# Altium project BatteryBoard.PrjPcb
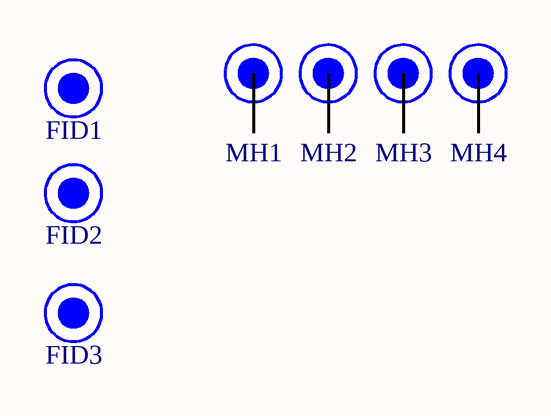
[diagram p0: Title.SchDoc]
Project_Date: 13/03/2019; Project_Designer1: Olivier Belval; Project_Designer2: Philippe Marcoux; Project_Global: SecurBot; Project_Group: SecurBot; Project_Name: BatteryBoard; Project_Revision: 1
6 sheets, 145 parts. Net scope: flat (ports and power ports of the same name join across sheets).
Board files: BatteryBoardTEST.PcbDoc, BatteryBoard.PcbDoc
Sheets:
  Title.SchDoc
  Battery Front End.SchDoc
  BatteryCharger.SchDoc
  MC.SchDoc
  ADC.SchDoc
  DC_DC_5V.SchDoc

## Sheet Title.SchDoc
size Tabloid; Date: Date; Author: Author 1; Revision: 1; Size: 11x17; Sheet_Name: Sheet Description

### Parts
FID1  Fiducial 1mm  [FID_1MM]  (value not drawn)
FID2  Fiducial 1mm  [FID_1MM]  (value not drawn)
FID3  Fiducial 1mm  [FID_1MM]  (value not drawn)
MH1  Mounting Hole 6/32  [MH_ENG_6-32]  (value not drawn)
MH2  Mounting Hole 6/32  [MH_ENG_6-32]  (value not drawn)
MH3  Mounting Hole 6/32  [MH_ENG_6-32]  (value not drawn)
MH4  Mounting Hole 6/32  [MH_ENG_6-32]  (value not drawn)

### Nets

Not connected (* = marked no-connect by the designer): MH1 1; MH2 1; MH3 1; MH4 1

### Notes on the sheet
- Revision history
- Package size conversion
- Metric
- 1005
- 1608
- Imperial
- 0402
- 0603
- Revision
- 2012
- 3216
- 0805
- 1206
- 3225
- 6432
- 1210
- 2512
- Date :
- Project Title
- Global Project
- Size
- Group
- Date
- Sheet
- of
- Filename
- Designers

### Library data of the parts
FID1-FID3 = FID - 1MM
MH1-MH4 = MH - 6-32

## Sheet Battery Front End.SchDoc
size Tabloid; Date: Date; Author: Author 1; Revision: 1; Size: 11x17; Sheet_Name: Battery front end
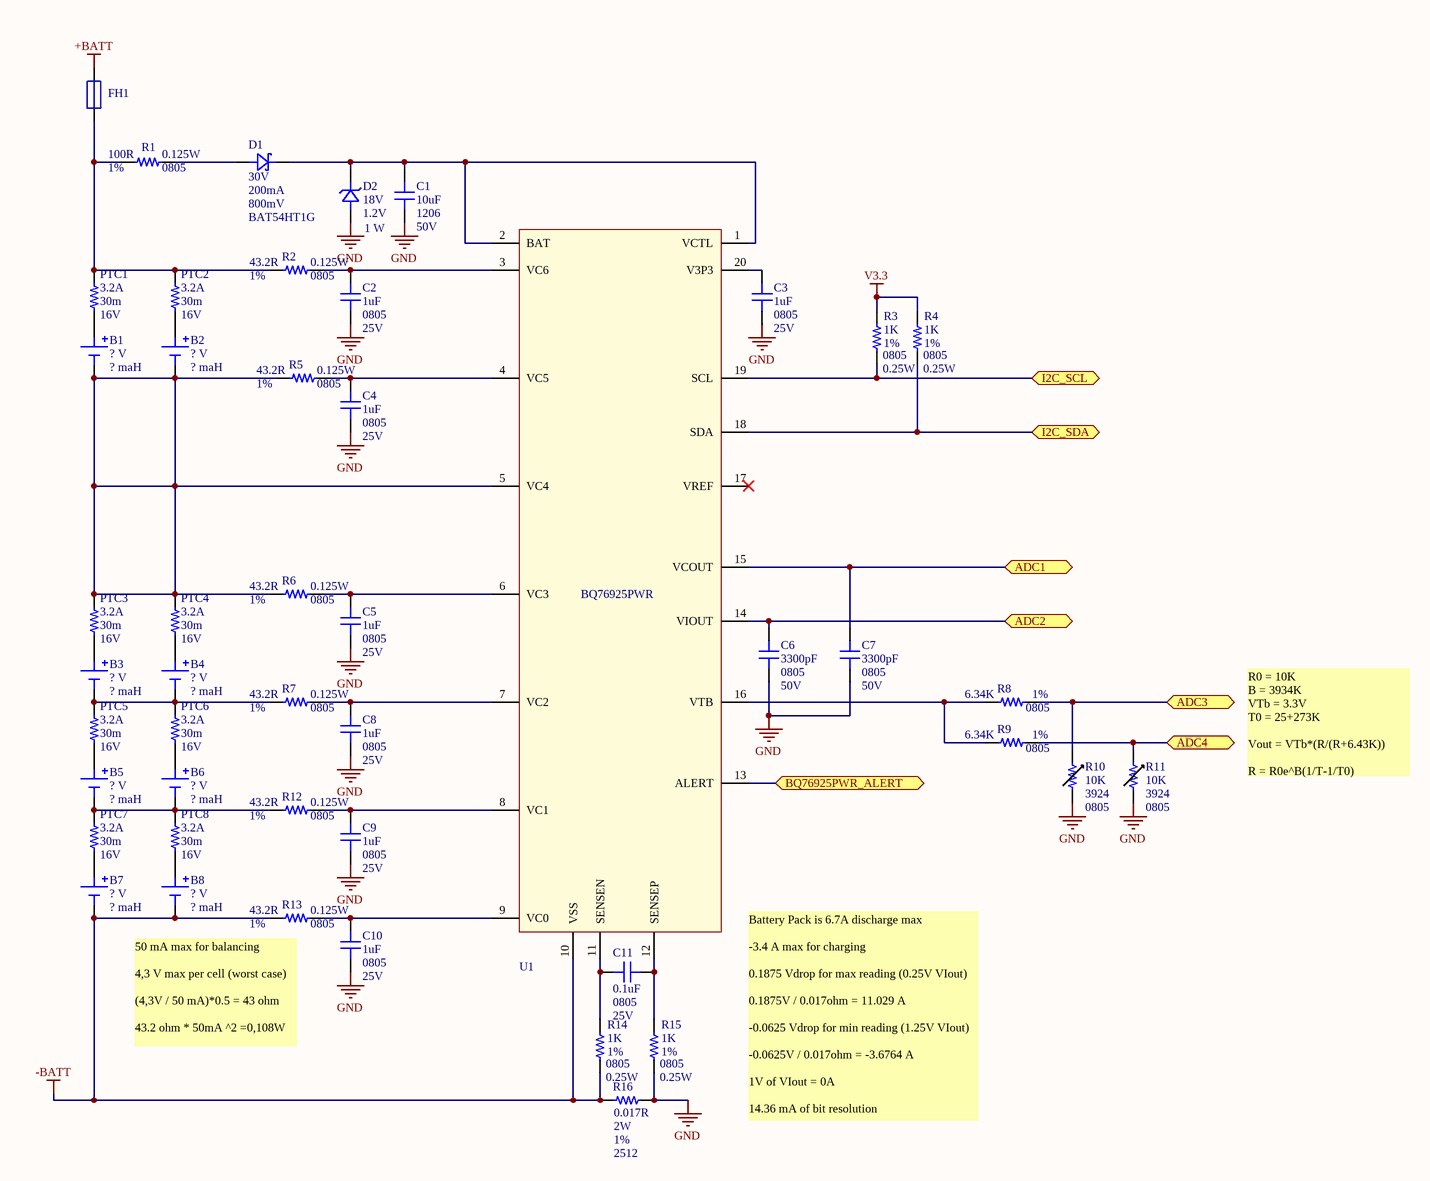
[diagram p1: Battery Front End.SchDoc]

### Parts
B1  Voltage: ? V  Charge: ? maH  [18650 PC PIN]  (hidden comment: Battery Cell 18650)
B2  Voltage: ? V  Charge: ? maH  [18650 PC PIN]  (hidden comment: Battery Cell 18650)
B3  Voltage: ? V  Charge: ? maH  [18650 PC PIN]  (hidden comment: Battery Cell 18650)
B4  Voltage: ? V  Charge: ? maH  [18650 PC PIN]  (hidden comment: Battery Cell 18650)
B5  Voltage: ? V  Charge: ? maH  [18650 PC PIN]  (hidden comment: Battery Cell 18650)
B6  Voltage: ? V  Charge: ? maH  [18650 PC PIN]  (hidden comment: Battery Cell 18650)
B7  Voltage: ? V  Charge: ? maH  [18650 PC PIN]  (hidden comment: Battery Cell 18650)
B8  Voltage: ? V  Charge: ? maH  [18650 PC PIN]  (hidden comment: Battery Cell 18650)
C1  value 10uF  Package: 1206  Voltage: 50V  [CAP_1206]  (hidden comment: CAP_GRT31CR61H106ME01L‎)
C2  value 1uF  Package: 0805  Voltage: 25V  [CAP_0805]  (hidden comment: CAP_‎‎‎‎CL21B105KAFNNNE‎)
C3  value 1uF  Package: 0805  Voltage: 25V  [CAP_0805]  (hidden comment: CAP_‎‎‎‎CL21B105KAFNNNE‎)
C4  value 1uF  Package: 0805  Voltage: 25V  [CAP_0805]  (hidden comment: CAP_‎‎‎‎CL21B105KAFNNNE‎)
C5  value 1uF  Package: 0805  Voltage: 25V  [CAP_0805]  (hidden comment: CAP_‎‎‎‎CL21B105KAFNNNE‎)
C6  value 3300pF  Package: 0805  Voltage: 50V  [CAP_0805]  (hidden comment: CAP_CL21B332KBANNNC‎)
C7  value 3300pF  Package: 0805  Voltage: 50V  [CAP_0805]  (hidden comment: CAP_CL21B332KBANNNC‎)
C8  value 1uF  Package: 0805  Voltage: 25V  [CAP_0805]  (hidden comment: CAP_‎‎‎‎CL21B105KAFNNNE‎)
C9  value 1uF  Package: 0805  Voltage: 25V  [CAP_0805]  (hidden comment: CAP_‎‎‎‎CL21B105KAFNNNE‎)
C10  value 1uF  Package: 0805  Voltage: 25V  [CAP_0805]  (hidden comment: CAP_‎‎‎‎CL21B105KAFNNNE‎)
C11  value 0.1uF  Package: 0805  Voltage: 25V  [CAP_0805]  (hidden comment: CAP_‎‎CC0805KRX7R8BB104‎)
D1  Voltage: 30V  Current: 200mA  Vf: 800mV  Part number: BAT54HT1G  [SOD-323]  (hidden comment: DIODE_SCH_BAT54HT1G)
D2  Voltage: 18V  Vf: 1.2V  Power: 1 W  [DO-214AC]  (hidden comment: DIODE_ZEN_SMAZ18-13-F)
FH1  FH 3AB-3AG  [FH_3AB_3AG]  (value not drawn)
PTC1  Trip value: 3.2A  Res: 30m  Voltage: 16V  [PTC - 1812]  (hidden comment: PTC_0ZCG0160BF2C)
PTC2  Trip value: 3.2A  Res: 30m  Voltage: 16V  [PTC - 1812]  (hidden comment: PTC_0ZCG0160BF2C)
PTC3  Trip value: 3.2A  Res: 30m  Voltage: 16V  [PTC - 1812]  (hidden comment: PTC_0ZCG0160BF2C)
PTC4  Trip value: 3.2A  Res: 30m  Voltage: 16V  [PTC - 1812]  (hidden comment: PTC_0ZCG0160BF2C)
PTC5  Trip value: 3.2A  Res: 30m  Voltage: 16V  [PTC - 1812]  (hidden comment: PTC_0ZCG0160BF2C)
PTC6  Trip value: 3.2A  Res: 30m  Voltage: 16V  [PTC - 1812]  (hidden comment: PTC_0ZCG0160BF2C)
PTC7  Trip value: 3.2A  Res: 30m  Voltage: 16V  [PTC - 1812]  (hidden comment: PTC_0ZCG0160BF2C)
PTC8  Trip value: 3.2A  Res: 30m  Voltage: 16V  [PTC - 1812]  (hidden comment: PTC_0ZCG0160BF2C)
R1  value 100R  Package: 0805  Power: 0.125W  Tolerance: 1%  [RES_0805]  (hidden comment: RES_‎‎‎ERA-6AEB101V‎)
R2  value 43.2R  Package: 0805  Power: 0.125W  Tolerance: 1%  [RES_0805]  (hidden comment: RES_‎ERJ-6ENF43R2V‎)
R3  value 1K  Package: 0805  Power: 0.25W  Tolerance: 1%  [RES_0805]  (hidden comment: RES_‎‎‎‎RNCP0805FTD1K00‎)
R4  value 1K  Package: 0805  Power: 0.25W  Tolerance: 1%  [RES_0805]  (hidden comment: RES_‎‎‎‎RNCP0805FTD1K00‎)
R5  value 43.2R  Package: 0805  Power: 0.125W  Tolerance: 1%  [RES_0805]  (hidden comment: RES_‎ERJ-6ENF43R2V‎)
R6  value 43.2R  Package: 0805  Power: 0.125W  Tolerance: 1%  [RES_0805]  (hidden comment: RES_‎ERJ-6ENF43R2V‎)
R7  value 43.2R  Package: 0805  Power: 0.125W  Tolerance: 1%  [RES_0805]  (hidden comment: RES_‎ERJ-6ENF43R2V‎)
R8  value 6.34K  Package: 0805  Tolerance: 1%  [RES_0805]  (hidden comment: RES_‎‎‎CRCW08056K34FKEA)
R9  value 6.34K  Package: 0805  Tolerance: 1%  [RES_0805]  (hidden comment: RES_‎‎‎CRCW08056K34FKEA)
R10  Resistance @ 25C: 10K  B: 3924  Package: 0805  [RES_0805]  (hidden comment: RES_TH_NCP21XV103J03RA)
R11  Resistance @ 25C: 10K  B: 3924  Package: 0805  [RES_0805]  (hidden comment: RES_TH_NCP21XV103J03RA)
R12  value 43.2R  Package: 0805  Power: 0.125W  Tolerance: 1%  [RES_0805]  (hidden comment: RES_‎ERJ-6ENF43R2V‎)
R13  value 43.2R  Package: 0805  Power: 0.125W  Tolerance: 1%  [RES_0805]  (hidden comment: RES_‎ERJ-6ENF43R2V‎)
R14  value 1K  Package: 0805  Power: 0.25W  Tolerance: 1%  [RES_0805]  (hidden comment: RES_‎‎‎‎RNCP0805FTD1K00‎)
R15  value 1K  Package: 0805  Power: 0.25W  Tolerance: 1%  [RES_0805]  (hidden comment: RES_‎‎‎‎RNCP0805FTD1K00‎)
R16  value 0.017R  Package: 2512  Power: 2W  Tolerance: 1%  [RES_2512]  (hidden comment: RES_‎WSL2512R0170FEA18)
U1  IC_BATT_BQ76925PWR  [BQ76925]  (value not drawn)

### Ports
ADC1, ADC2, ADC3, ADC4, BQ76925PWR_ALERT, I2C_SCL, I2C_SDA

### Nets
+BATT: FH1.2
-BATT: B7.2 B8.2 R13.1 R14.2 R16.1 U1.10(VSS)
GND: C1.2 C2.2 C3.2 C4.2 C5.2 C6.2 C7.2 C8.2 C9.2 C10.2 D2.1 R10.2 R11.2 R15.2 R16.2
V3.3: R3.1 R4.1
SCL: R3.2 U1.19(SCL) ; port I2C_SCL
SDA: R4.2 U1.18(SDA) ; port I2C_SDA
NetB1_1: B1.1 PTC1.2
NetB1_2: B1.2 B2.2 PTC3.1 PTC4.1 R5.1 R6.1 U1.5(VC4)
NetB2_1: B2.1 PTC2.2
NetB3_1: B3.1 PTC3.2
NetB3_2: B3.2 B4.2 PTC5.1 PTC6.1 R7.1
NetB4_1: B4.1 PTC4.2
NetB5_1: B5.1 PTC5.2
NetB5_2: B5.2 B6.2 PTC7.1 PTC8.1 R12.1
NetB6_1: B6.1 PTC6.2
NetB7_1: B7.1 PTC7.2
NetB8_1: B8.1 PTC8.2
NetC1_1: C1.1 D1.2 D2.2 U1.1(VCTL) U1.2(BAT)
NetC2_1: C2.1 R2.2 U1.3(VC6)
NetC3_1: C3.1 U1.20(V3P3)
NetC4_1: C4.1 R5.2 U1.4(VC5)
NetC5_1: C5.1 R6.2 U1.6(VC3)
NetC6_1: C6.1 U1.14(VIOUT) ; port ADC2
NetC7_1: C7.1 U1.15(VCOUT) ; port ADC1
NetC8_1: C8.1 R7.2 U1.7(VC2)
NetC9_1: C9.1 R12.2 U1.8(VC1)
NetC10_1: C10.1 R13.2 U1.9(VC0)
NetC11_1: C11.1 R14.1 U1.11(SENSEN)
NetC11_2: C11.2 R15.1 U1.12(SENSEP)
NetD1_1: D1.1 R1.2
NetFH1_1: FH1.1 PTC1.1 PTC2.1 R1.1 R2.1
NetR8_1: R8.1 R9.1 U1.16(VTB)
NetR8_2: R8.2 R10.1 ; port ADC3
NetR9_2: R9.2 R11.1 ; port ADC4
NetU1_13: U1.13(ALERT) ; port BQ76925PWR_ALERT

Not connected (* = marked no-connect by the designer): U1 17(VREF)*

### Notes on the sheet
- R0 = 10K
  B = 3934K
  VTb = 3.3V
  T0 = 25+273K
  Vout = VTb*(R/(R+6.43K))
  R = R0e^B(1/T-1/T0)
- 50 mA max for balancing
  4,3 V max per cell (worst case)
  (4,3V / 50 mA)*0.5 = 43 ohm
  43.2 ohm * 50mA ^2 =0,108W
- (near U1) Battery Pack is 6.7A discharge max
  -3.4 A max for charging
  0.1875 Vdrop for max reading (0.25V VIout)
  0.1875V / 0.017ohm = 11.029 A
  -0.0625 Vdrop for min reading (1.25V VIout)
  -0.0625V / 0.017ohm = -3.6764 A
  1V of VIout = 0A
  14.36 mA of bit resolution
- Sheet Name
- Project Title
- Global Project
- Size
- Group
- Revision
- Date
- Sheet
- of
- Filename
- Designers

### Library data of the parts
C1 = CAP_GRT31CR61H106ME01L‎: CAP CER 10uF 50V 1206; Part number: GRT31CR61H106ME01L‎
C2-C5 C8-C10 = CAP_‎‎‎‎CL21B105KAFNNNE‎: CAP CER 1uF 25V 0805; Part number: CL21B105KAFNNNE‎
C6 C7 = CAP_CL21B332KBANNNC‎: CAP CER 3300pF 50V 0805; Part number: CL21B332KBANNNC‎
C11 = CAP_‎‎CC0805KRX7R8BB104‎: CAP CER 0.1uF 25V 0805; Part number: CC0805KRX7R8BB104‎
D1 = DIODE_SCH_BAT54HT1G: Diode Schottky 30V 200mA (DC); Package: SOD-323
D2 = DIODE_ZEN_SMAZ18-13-F: Diode Zener 18V 1W ±5%; Current: ?A; Part number: SMAZ18-13-F
FH1 = FH 3AB-3AG: Fuse holder (3AB-3AG); Part number: *
PTC1-PTC8 = PTC_0ZCG0160BF2C: PTC_Polymeric PTC Resettable Fuse 16V 1.6A Ih; Part number: 0ZCG0160BF2C; Package: 1812
R1 = RES_‎‎‎ERA-6AEB101V‎: RES 100R 1% 1/8W 0805; Part number: ‎ERA-6AEB101V‎
R2 R5-R7 R12 R13 = RES_‎ERJ-6ENF43R2V‎: RES 43.2R 1% 1/8W 0805; Part number: ‎ERJ-6ENF43R2V‎
R3 R4 R14 R15 = RES_‎‎‎‎RNCP0805FTD1K00‎: RES 1K 1% 1/4W 0805; Part number: RNCP0805FTD1K00‎
R8 R9 = RES_‎‎‎CRCW08056K34FKEA: RES 6.34K 1% 1/8W 0805; Power: 0.125W; Part number: CRCW08056K34FKEA
R10 R11 = RES_TH_NCP21XV103J03RA: Thermistor 10K - 0805; Part number: SHYLPCKB
R16 = RES_‎WSL2512R0170FEA18: RES 0.017R 1% 2W 2512; Part number: ‎WSL2512R0170FEA18
U1 = IC_BATT_BQ76925PWR: Battery management system; Part Number: BQ76925PWR
B1-B8 = Battery Cell 18650: Part Number: *

## Sheet BatteryCharger.SchDoc
size Tabloid
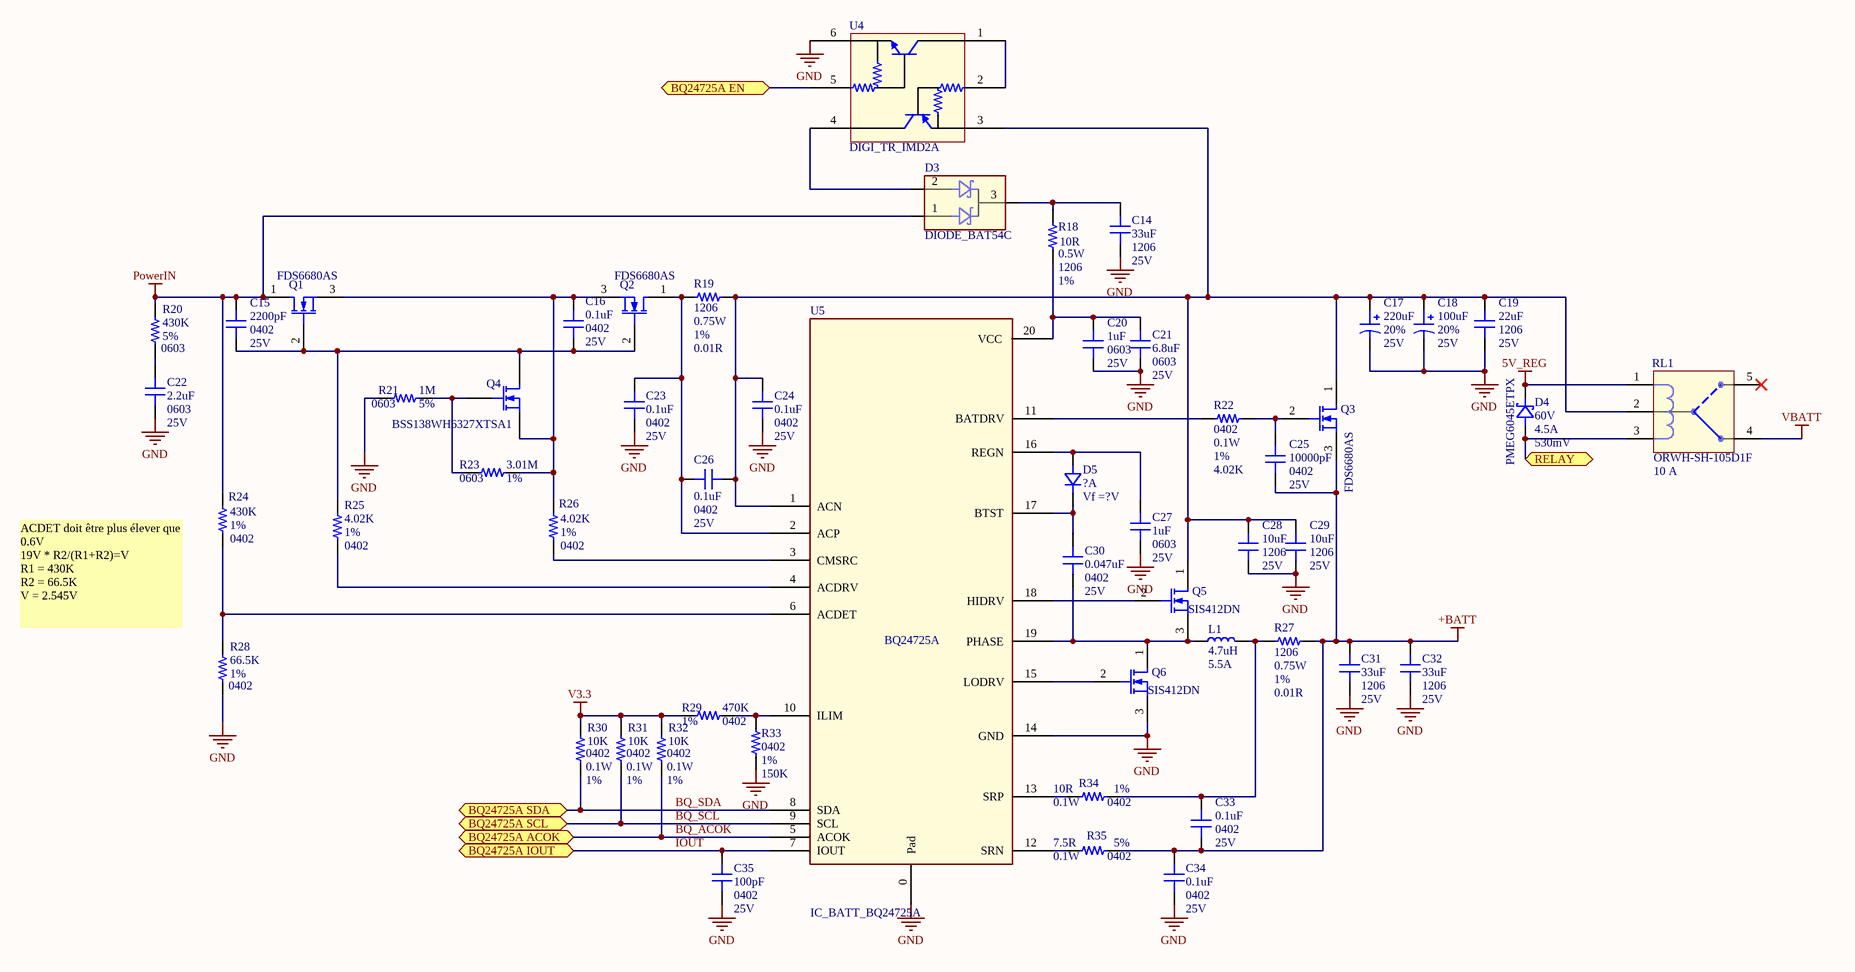
[diagram p2: BatteryCharger.SchDoc]

### Parts
C14  value 33uF  Package: 1206  Voltage: 25V  [CAP_1206]  (hidden comment: CAP_‎C3216JB1E336M160AC‎)
C15  value 2200pF  Package: 0402  Voltage: 25V  [CAP_0402]  (hidden comment: CAP_AC0402KRX7R8BB222‎)
C16  value 0.1uF  Package: 0402  Voltage: 25V  [CAP_0402]  (hidden comment: CAP_‎‎CL05A104KA5NNNC‎)
C17  value 220uF  Tolerance: 20%  Voltage: 25V  [CAP UWT 8x10]  (hidden comment: CAP_UWT1E221MNL1GS)
C18  value 100uF  Tolerance: 20%  Voltage: 25V  [CAP ALU - 6.3mm DIA]  (hidden comment: CAP_UWT1E101MCL1GS)
C19  value 22uF  Package: 1206  Voltage: 25V  [CAP_1206]  (hidden comment: CAP_‎‎CL31A226KAHNNNE‎)
C20  value 1uF  Package: 0603  Voltage: 25V  [CAP_0603]  (hidden comment: CAP_‎CL10A105KA8NNNC‎)
C21  value 6.8uF  Package: 0603  Voltage: 25V  [CAP_0603]  (hidden comment: CAP_‎‎‎C1608X5R1E685K080AC)
C22  value 2.2uF  Package: 0603  Voltage: 25V  [CAP_0603]  (hidden comment: CAP_‎‎GRM188R61E225KA12D‎)
C23  value 0.1uF  Package: 0402  Voltage: 25V  [CAP_0402]  (hidden comment: CAP_‎‎CL05A104KA5NNNC‎)
C24  value 0.1uF  Package: 0402  Voltage: 25V  [CAP_0402]  (hidden comment: CAP_‎‎CL05A104KA5NNNC‎)
C25  value 10000pF  Package: 0402  Voltage: 25V  [CAP_0402]  (hidden comment: CAP_‎CL05B103KA5NNNC‎)
C26  value 0.1uF  Package: 0402  Voltage: 25V  [CAP_0402]  (hidden comment: CAP_‎‎CL05A104KA5NNNC‎)
C27  value 1uF  Package: 0603  Voltage: 25V  [CAP_0603]  (hidden comment: CAP_‎CL10A105KA8NNNC‎)
C28  value 10uF  Package: 1206  Voltage: 25V  [CAP_1206]  (hidden comment: CAP_‎CL31A106KAHNFNE‎)
C29  value 10uF  Package: 1206  Voltage: 25V  [CAP_1206]  (hidden comment: CAP_‎CL31A106KAHNFNE‎)
C30  value 0.047uF  Package: 0402  Voltage: 25V  [CAP_0402]  (hidden comment: CAP_‎‎‎C0402C473K3RACAUTO‎)
C31  value 33uF  Package: 1206  Voltage: 25V  [CAP_1206]  (hidden comment: CAP_‎C3216JB1E336M160AC‎)
C32  value 33uF  Package: 1206  Voltage: 25V  [CAP_1206]  (hidden comment: CAP_‎C3216JB1E336M160AC‎)
C33  value 0.1uF  Package: 0402  Voltage: 25V  [CAP_0402]  (hidden comment: CAP_‎‎CL05A104KA5NNNC‎)
C34  value 0.1uF  Package: 0402  Voltage: 25V  [CAP_0402]  (hidden comment: CAP_‎‎CL05A104KA5NNNC‎)
C35  value 100pF  Package: 0402  Voltage: 25V  [CAP_0402]  (hidden comment: CAP_‎‎‎‎CC0402KRX7R8BB101‎)
D3  DIODE_BAT54C  [BAT54C]
D4  Voltage: 60V  Current: 4.5A  Vf: 530mV  Part number: PMEG6045ETPX  [DO-214AC_SOD128]  (hidden comment: DIODE_SCH_PMEG6045ETPX)
D5  Current: ?A  Vf: Vf =?V  [BAT54]  (hidden comment: DIODE BAT54)
L1  value 4.7uH  Current: 5.5A  [ASPI-0630LR]  (hidden comment: IND_ASPI-0630LR)
Q1  Part number: FDS6680AS  [SO-8 FDS6680AS]  (hidden comment: NMOS_FDS6680AS)
Q2  Part number: FDS6680AS  [SO-8 FDS6680AS]  (hidden comment: NMOS_FDS6680AS)
Q3  Part number: FDS6680AS  [SO-8 FDS6680AS]  (hidden comment: NMOS_FDS6680AS)
Q4  Part number: BSS138WH6327XTSA1  [PG-SOT-323]  (hidden comment: MOSFET-N)
Q5  NMOS_SIS412DN  [SiS412DN]  (value not drawn)
Q6  NMOS_SIS412DN  [SiS412DN]  (value not drawn)
R18  value 10R  Power: 0.5W  Package: 1206  Tolerance: 1%  [RES_1206]  (hidden comment: RES_CRM1206-FX-10R0ELF‎)
R19  value 0.01R  Package: 1206  Power: 0.75W  Tolerance: 1%  [RES_1206]  (hidden comment: RES_‎‎‎KRL1632E-M-R010-F-T5)
R20  value 430K  Package: 0603  Tolerance: 5%  [RES_0603]  (hidden comment: RES_‎‎‎‎RC0603JR-07430KL‎)
R21  value 1M  Package: 0603  Tolerance: 5%  [RES_0603]  (hidden comment: RES_‎‎‎ERA-6AEB4020V‎_1)
R22  value 4.02K  Package: 0402  Power: 0.1W  Tolerance: 1%  [RES_0402]  (hidden comment: RES_‎‎‎ERJ-2RKF4021X‎)
R23  value 3.01M  Package: 0603  Tolerance: 1%  [RES_0603]  (hidden comment: RES_‎‎‎‎RC0603FR-073M01L‎)
R24  value 430K  Package: 0402  Tolerance: 1%  [RES_0402]  (hidden comment: RES_RC0402FR-07430KL‎)
R25  value 4.02K  Package: 0402  Tolerance: 1%  [RES_0402]  (hidden comment: RES_‎‎‎ERJ-2RKF4021X‎)
R26  value 4.02K  Package: 0402  Tolerance: 1%  [RES_0402]  (hidden comment: RES_‎‎‎ERJ-2RKF4021X‎)
R27  value 0.01R  Package: 1206  Power: 0.75W  Tolerance: 1%  [RES_1206]  (hidden comment: RES_‎‎‎KRL1632E-M-R010-F-T5)
R28  value 66.5K  Package: 0402  Tolerance: 1%  [RES_0402]  (hidden comment: RES_‎‎‎‎RMCF0402FT66K5)
R29  value 470K  Package: 0402  Tolerance: 1%  [RES_0402]  (hidden comment: RES_MCS04020C4703FE000‎)
R30  value 10K  Package: 0402  Power: 0.1W  Tolerance: 1%  [RES_0402]  (hidden comment: RES_‎MCS0402MC1002FE000‎)
R31  value 10K  Package: 0402  Power: 0.1W  Tolerance: 1%  [RES_0402]  (hidden comment: RES_‎MCS0402MC1002FE000‎)
R32  value 10K  Package: 0402  Power: 0.1W  Tolerance: 1%  [RES_0402]  (hidden comment: RES_‎MCS0402MC1002FE000‎)
R33  value 150K  Package: 0402  Tolerance: 1%  [RES_0402]  (hidden comment: RES_‎‎‎MCS04020C1503FE000‎)
R34  value 10R  Power: 0.1W  Tolerance: 1%  Package: 0402  [RES_0402]  (hidden comment: RES_ERJ-2RKF10R0X‎)
R35  value 7.5R  Package: 0402  Power: 0.1W  Tolerance: 5%  [RES_0402]  (hidden comment: RES_‎‎‎ERJ-2GEJ7R5X‎)
RL1  Part number: ORWH-SH-105D1F  A max: 10 A  [ORWH-SH]  (hidden comment: Relay SPDT)
U4  DIGI_TR_IMD2A  [IMD2A]
U5  IC_BATT_BQ24725A  [bq24725A]

### Ports
BQ24725A ACOK, BQ24725A EN, BQ24725A IOUT, BQ24725A SCL, BQ24725A SDA, RELAY

### Nets
5V_REG: D4.2 RL1.1
+BATT: C25.2 C31.1 C32.1 C33.2 C34.1 Q3.3(S) R27.2 R35.2
GND: C14.2 C17.2 C18.2 C19.2 C20.2 C21.2 C22.2 C23.2 C24.2 C27.2 C28.2 C29.2 C31.2 C32.2 C34.2 C35.2 Q6.3(S) R21.1 R28.2 R33.1 U4.6 U5.0(Pad) U5.14(GND)
PowerIN: C15.1 D3.1 Q1.1(D) R20.1 R24.1
V3.3: R29.1 R30.1 R31.1 R32.1
VBATT: RL1.4
BQ_ACOK: R32.2 U5.5(ACOK) ; port BQ24725A ACOK
BQ_SCL: R31.2 U5.9(SCL) ; port BQ24725A SCL
BQ_SDA: R30.2 U5.8(SDA) ; port BQ24725A SDA
IOUT: C35.1 U5.7(IOUT) ; port BQ24725A IOUT
NetC14_1: C14.1 D3.3 R18.1
NetC15_2: C15.2 C16.2 Q1.2(G) Q2.2(G) Q4.3(D) R25.1
NetC16_1: C16.1 Q1.3(S) Q2.3(S) Q4.2(S) R23.2 R26.1
NetC17_1: C17.1 C18.1 C19.1 C24.1 C26.2 C28.1 C29.1 Q3.1(D) Q5.1(D) R19.2 RL1.2 U4.3 U5.1(ACN)
NetC20_1: C20.1 C21.1 R18.2 U5.20(VCC)
NetC22_1: C22.1 R20.2
NetC23_1: C23.1 C26.1 Q2.1(D) R19.1 U5.2(ACP)
NetC25_1: C25.1 Q3.2(G) R22.2
NetC27_1: C27.1 D5.1 U5.16(REGN)
NetC30_1: C30.1 D5.3 U5.17(BTST)
NetC30_2: C30.2 L1.1 Q5.3(S) Q6.1(D) U5.19(PHASE)
NetC33_1: C33.1 L1.2 R27.1 R34.2
NetD3_2: D3.2 U4.4
NetD4_1: D4.1 RL1.3 ; port RELAY
NetQ4_1: Q4.1(G) R21.2 R23.1
NetQ5_2: Q5.2(G) U5.18(HIDRV)
NetQ6_2: Q6.2(G) U5.15(LODRV)
NetR22_1: R22.1 U5.11(BATDRV)
NetR24_2: R24.2 R28.1 U5.6(ACDET)
NetR25_2: R25.2 U5.4(ACDRV)
NetR26_2: R26.2 U5.3(CMSRC)
NetR29_2: R29.2 R33.2 U5.10(ILIM)
NetR34_1: R34.1 U5.13(SRP)
NetR35_1: R35.1 U5.12(SRN)
NetU4_1: U4.1 U4.2
NetU4_5: U4.5 ; port BQ24725A EN

Not connected (* = marked no-connect by the designer): RL1 5*

### Notes on the sheet
- ACDET doit être plus élever que 0.6V
  19V * R2/(R1+R2)=V
  R1 = 430K
  R2 = 66.5K
  V = 2.545V
- Sheet Name
- Project Title
- Global Project
- Size
- Group
- Revision
- Date
- Sheet
- of
- Filename
- Designers

### Library data of the parts
C14 C31 C32 = CAP_‎C3216JB1E336M160AC‎: CAP CER 33uF 25V 1206; Part number: C3216JB1E336M160AC‎
C15 = CAP_AC0402KRX7R8BB222‎: CAP CER 2200PF 25V 0402; Part number: AC0402KRX7R8BB222‎
C16 C23 C24 C26 C33 C34 = CAP_‎‎CL05A104KA5NNNC‎: CAP CER 0.1uF 25V 0402; Part number: CL05A104KA5NNNC‎
C17 = CAP_UWT1E221MNL1GS: CAP ALU 220µF 25V; Part number: UWT1E221MNL1GS; Package: 8.30mm x 8.30mm
C18 = CAP_UWT1E101MCL1GS: CAP ALU 100µF 25V; Part number: UWT1E101MCL1GS; Package: 6.60mm x 6.60mm
C19 = CAP_‎‎CL31A226KAHNNNE‎: CAP CER 22uF 25V 1206; Part number: CL31A226KAHNNNE‎
C20 C27 = CAP_‎CL10A105KA8NNNC‎: CAP CER 1uF 25V 0603; Part number: CL10A105KA8NNNC‎
C21 = CAP_‎‎‎C1608X5R1E685K080AC: CAP CER 6.8uF 25V 0603; Part number: C1608X5R1E685K080AC
C22 = CAP_‎‎GRM188R61E225KA12D‎: CAP CER 2.2uF 25V 0603; Part number: GRM188R61E225KA12D‎
C25 = CAP_‎CL05B103KA5NNNC‎: CAP CER 10000pF 25V 0402; Part number: ‎CL05B103KA5NNNC‎
C28 C29 = CAP_‎CL31A106KAHNFNE‎: CAP CER 10uF 25V 1206; Part number: CL31A106KAHNFNE‎
C30 = CAP_‎‎‎C0402C473K3RACAUTO‎: CAP CER 0.047uF 25V 0402; Part number: ‎C0402C473K3RACAUTO‎
C35 = CAP_‎‎‎‎CC0402KRX7R8BB101‎: CAP CER 100pF 25V 0402; Part number: CC0402KRX7R8BB101‎
D3 = DIODE_BAT54C: Dual input Diode; Part number: BAT54C
D4 = DIODE_SCH_PMEG6045ETPX: Diode Schottky 60V 4.5A Surface Mount CFP5; Package: SOD-128
D5 = DIODE BAT54: Part number: BAT54C
L1 = IND_ASPI-0630LR: 4.7µH Shielded Molded Inductor 5.5A 35mOhm; Package: 7.20mm x 6.65mm; Part number: ASPI-0630LR
Q1-Q3 = NMOS_FDS6680AS: NMOS_N-Channel 30V 11.5A (Ta) 2.5W (Ta) Surface Mount 8-SOIC; Vgs: 20V; Package: PG-SOT323-3; Id: 11.5A; Vdss: 30V
Q4 = MOSFET-N: N-Channel MOSFET; Published: 8-Jun-2000; LatestRevisionDate: 17-Jul-2002; LatestRevisionNote: Re-released for DXP Platform.; PackageVersion: 1995/1996; PackageReference: E3; Publisher: Altium Limited; PackageDescription: TO, Flat Index; 3 In-Line, Axial Leads; Body Dia. 4.6mm; Lead Dia. 0.5 mm (max)
Q5 Q6 = NMOS_SIS412DN: NMOS_N-Channel 30V 12A (Tc) 3.2W (Ta), 15.6W (Tc); Vgs: 20V; Package: PowerPAK® 1212-8; Id: 12A; Vdss: 30V; Part number: SIS412DN
R18 = RES_CRM1206-FX-10R0ELF‎: RES 10R 1% 1/2W 1206; Part number: CRM1206-FX-10R0ELF‎
R19 R27 = RES_‎‎‎KRL1632E-M-R010-F-T5: RES 0.01R 1% 3/4W 1206; Part number: KRL1632E-M-R010-F-T5
R20 = RES_‎‎‎‎RC0603JR-07430KL‎: RES 430K 5% 1/10W 0603; Power: 0.1W; Part number: RC0603JR-07430KL‎
R21 = RES_‎‎‎ERA-6AEB4020V‎_1: RES 1M 5% 1/10W 0603; Power: 0.1W; Part number: ‎ERA-6AEB4020V‎
R22 = RES_‎‎‎ERJ-2RKF4021X‎: RES 4.02K 1% 1/10W 0402; Part number: ERJ-2RKF4021X‎
R23 = RES_‎‎‎‎RC0603FR-073M01L‎: RES 3.01M 1% 1/10W 0603; Power: 0.1W; Part number: RC0603FR-073M01L‎
R24 = RES_RC0402FR-07430KL‎: RES 430K 1% 1/16W 0402; Power: 0.0625W; Part number: RC0402FR-07430KL‎
R25 R26 = RES_‎‎‎ERJ-2RKF4021X‎: RES 4.02K 1% 1/10W 0402; Power: 0.1W; Part number: ERJ-2RKF4021X‎
R28 = RES_‎‎‎‎RMCF0402FT66K5: RES 66.5K 1% 1/16W 0402; Power: 0.0625W; Part number: RMCF0402FT66K5
R29 = RES_MCS04020C4703FE000‎: RES 470K 1% 1/10W 0402; Power: 0.1W; Part number: MCS04020C4703FE000‎
R30-R32 = RES_‎MCS0402MC1002FE000‎: RES 10K 1% 1/10W 0402; Part number: ‎MCS0402MC1002FE000‎
R33 = RES_‎‎‎MCS04020C1503FE000‎: RES 150K 1% 1/10W 0402; Power: 0.1W; Part number: MCS04020C1503FE000‎
R34 = RES_ERJ-2RKF10R0X‎: RES 10R 1% 1/10W 0402; Part number: ERJ-2RKF10R0X‎
R35 = RES_‎‎‎ERJ-2GEJ7R5X‎: RES 7.5R 5% 1/10W 0402; Part number: ERJ-2GEJ7R5X‎
U4 = DIGI_TR_IMD2A: Dual digital Transistor; Part number: IMD2A
U5 = IC_BATT_BQ24725A: Battery Charger; Part number: BQ24725A

## Sheet MC.SchDoc
size Tabloid; Date: Date; Author: Author 1; Revision: 1; Size: 11x17; Sheet_Name: Sheet Description
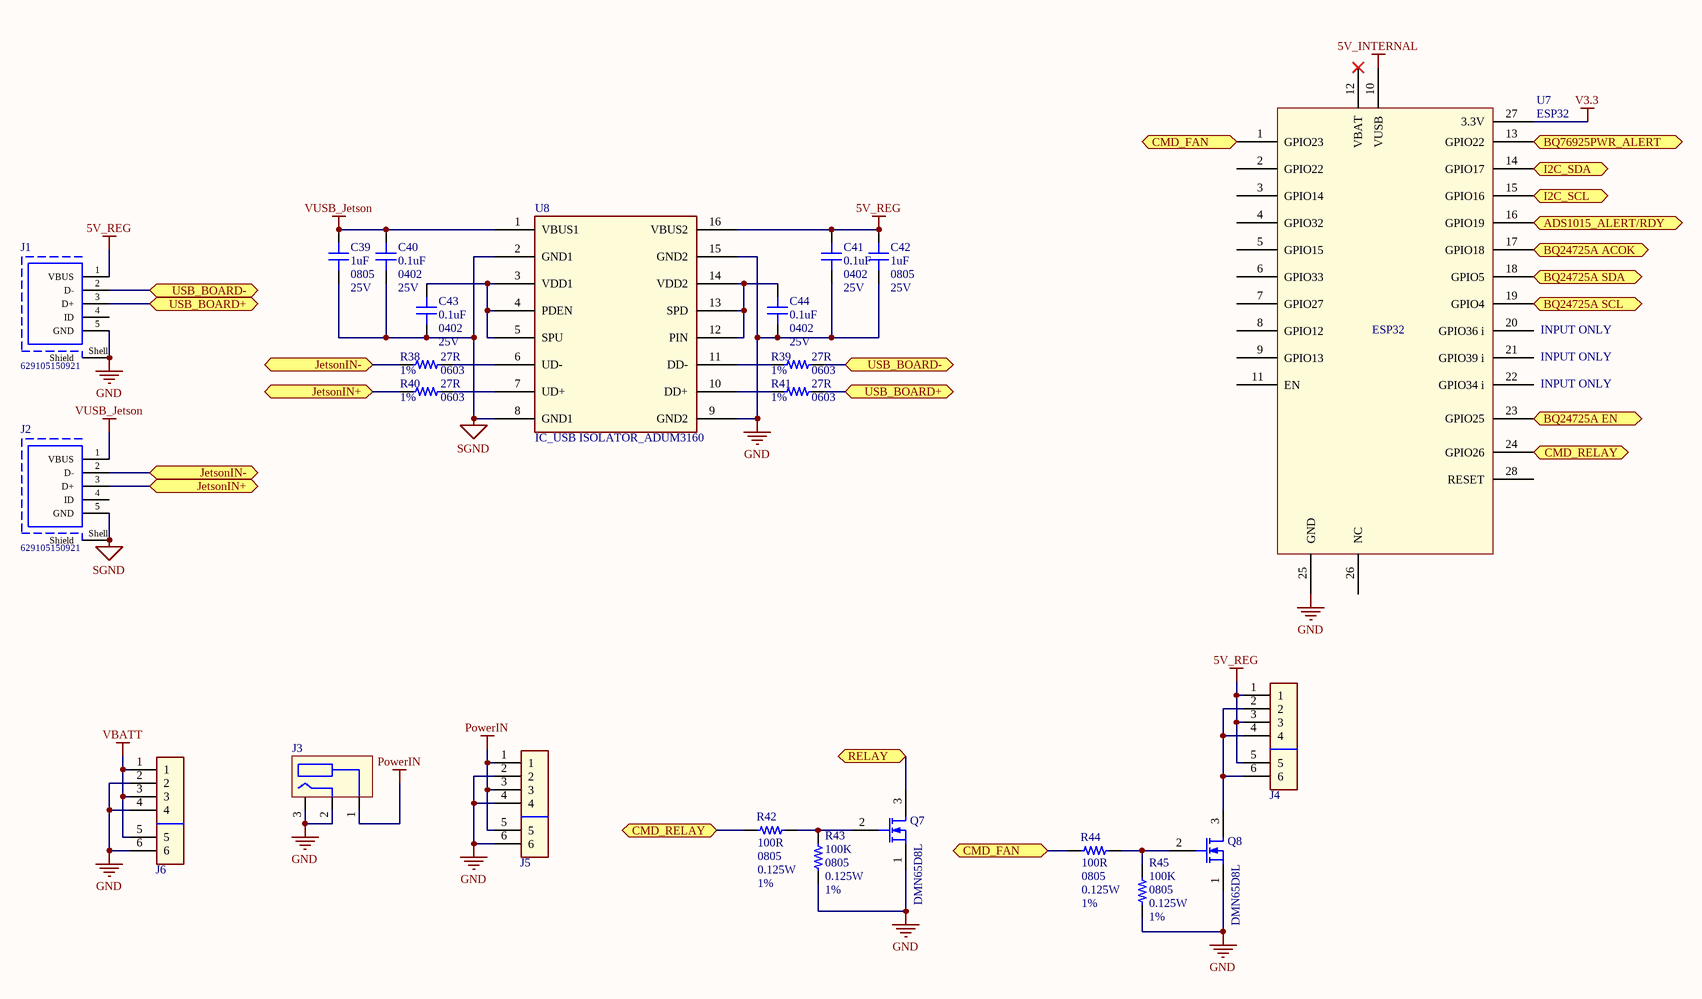
[diagram p3: MC.SchDoc]

### Parts
C39  value 1uF  Package: 0805  Voltage: 25V  [CAP_0805]  (hidden comment: CAP_‎‎‎‎CL21B105KAFNNNE‎)
C40  value 0.1uF  Package: 0402  Voltage: 25V  [CAP_0402]  (hidden comment: CAP_‎‎CL05A104KA5NNNC‎)
C41  value 0.1uF  Package: 0402  Voltage: 25V  [CAP_0402]  (hidden comment: CAP_‎‎CL05A104KA5NNNC‎)
C42  value 1uF  Package: 0805  Voltage: 25V  [CAP_0805]  (hidden comment: CAP_‎‎‎‎CL21B105KAFNNNE‎)
C43  value 0.1uF  Package: 0402  Voltage: 25V  [CAP_0402]  (hidden comment: CAP_‎‎CL05A104KA5NNNC‎)
C44  value 0.1uF  Package: 0402  Voltage: 25V  [CAP_0402]  (hidden comment: CAP_‎‎CL05A104KA5NNNC‎)
J1  629105150921  [629105150921]
J2  629105150921  [629105150921]
J3  Barrel 5.5x2.5mm  [Barrel 5.5mm 2.5mm]  (value not drawn)
J4  MOLEX 4 POS - TERMINAL BLOCK 2 POS  [MOLEX4POS_TERMBLOCK2POS]  (value not drawn)
J5  MOLEX 4 POS - TERMINAL BLOCK 2 POS  [MOLEX4POS_TERMBLOCK2POS]  (value not drawn)
J6  MOLEX 4 POS - TERMINAL BLOCK 2 POS  [MOLEX4POS_TERMBLOCK2POS]  (value not drawn)
Q7  Part number: DMN65D8L  [SOT-23]  (hidden comment: NMOS_DMN65D8L)
Q8  Part number: DMN65D8L  [SOT-23]  (hidden comment: NMOS_DMN65D8L)
R38  value 27R  Package: 0603  Tolerance: 1%  [RES_0603]  (hidden comment: RES_‎‎‎‎‎RMCF0603FT27R0‎)
R39  value 27R  Package: 0603  Tolerance: 1%  [RES_0603]  (hidden comment: RES_‎‎‎‎‎RMCF0603FT27R0‎)
R40  value 27R  Package: 0603  Tolerance: 1%  [RES_0603]  (hidden comment: RES_‎‎‎‎‎RMCF0603FT27R0‎)
R41  value 27R  Package: 0603  Tolerance: 1%  [RES_0603]  (hidden comment: RES_‎‎‎‎‎RMCF0603FT27R0‎)
R42  value 100R  Package: 0805  Power: 0.125W  Tolerance: 1%  [RES_0805]  (hidden comment: RES_‎‎‎ERA-6AEB101V‎)
R43  value 100K  Package: 0805  Power: 0.125W  Tolerance: 1%  [RES_0805]  (hidden comment: RES_‎RMCF0805FT100K‎)
R44  value 100R  Package: 0805  Power: 0.125W  Tolerance: 1%  [RES_0805]  (hidden comment: RES_‎‎‎ERA-6AEB101V‎)
R45  value 100K  Package: 0805  Power: 0.125W  Tolerance: 1%  [RES_0805]  (hidden comment: RES_‎RMCF0805FT100K‎)
U7  ESP32  [ESP32 V1]
U8  IC_USB ISOLATOR_ADUM3160  [SOIC16]

### Ports
ADS1015_ALERT/RDY, BQ24725A ACOK, BQ24725A EN, BQ24725A SCL, BQ24725A SDA, BQ76925PWR_ALERT, CMD_FAN, CMD_RELAY, I2C_SCL, I2C_SDA, JetsonIN+, JetsonIN-, RELAY, USB_BOARD+, USB_BOARD-

### Nets
5V_INTERNAL: U7.10(VUSB)
5V_REG: C41.1 C42.1 J1.1(VBUS) J4.1 J4.3 J4.5 U8.16(VBUS2)
GND: C41.2 C42.2 C44.2 J1.5(GND) J1.Shell(Shield) J3.2 J3.3 J5.2 J5.4 J5.6 J6.2 J6.4 J6.6 Q7.1(S) Q8.1(S) R43.2 R45.2 U7.25(GND) U8.9(GND2) U8.15(GND2)
PowerIN: J3.1 J5.1 J5.3 J5.5
SGND: C39.2 C40.2 C43.2 J2.5(GND) J2.Shell(Shield) U8.2(GND1) U8.8(GND1)
V3.3: U7.27(3.3V)
VBATT: J6.1 J6.3 J6.5
VUSB_Jetson: C39.1 C40.1 J2.1(VBUS) U8.1(VBUS1)
BQ_ACOK: U7.17(GPIO18) ; port BQ24725A ACOK
BQ_SCL: U7.19(GPIO4) ; port BQ24725A SCL
BQ_SDA: U7.18(GPIO5) ; port BQ24725A SDA
SCL: U7.15(GPIO16) ; port I2C_SCL
SDA: U7.14(GPIO17) ; port I2C_SDA
NetC43_1: C43.1 U8.3(VDD1) U8.4(PDEN) U8.5(SPU)
NetC44_1: C44.1 U8.12(PIN) U8.13(SPD) U8.14(VDD2)
NetD4_1: Q7.3(D) ; port RELAY
NetJ1_2: J1.2(D-) R39.2 ; port USB_BOARD-
NetJ1_3: J1.3(D+) R41.2 ; port USB_BOARD+
NetJ2_2: J2.2(D-) R38.1 ; port JetsonIN-
NetJ2_3: J2.3(D+) R40.1 ; port JetsonIN+
NetJ4_2: J4.2 J4.4 J4.6 Q8.3(D)
NetQ7_2: Q7.2(G) R42.1 R43.1
NetQ8_2: Q8.2(G) R44.1 R45.1
NetR17_2: U7.16(GPIO19) ; port ADS1015_ALERT/RDY
NetR38_2: R38.2 U8.6(UD-)
NetR39_1: R39.1 U8.11(DD-)
NetR40_2: R40.2 U8.7(UD+)
NetR41_1: R41.1 U8.10(DD+)
NetR42_2: R42.2 U7.24(GPIO26) ; port CMD_RELAY
NetR44_2: R44.2 U7.1(GPIO23) ; port CMD_FAN
NetU1_13: U7.13(GPIO22) ; port BQ76925PWR_ALERT
NetU4_5: U7.23(GPIO25) ; port BQ24725A EN

Not connected (* = marked no-connect by the designer): J1 4(ID); J2 4(ID); U7 2(GPIO22) 3(GPIO14) 4(GPIO32) 5(GPIO15) 6(GPIO33) 7(GPIO27) 8(GPIO12) 9(GPIO13) 11(EN) 12(VBAT)* 20(GPIO36_i) 21(GPIO39_i) 22(GPIO34_i) 26(NC) 28(RESET)

### Notes on the sheet
- (near U7) INPUT ONLY
- Sheet Name
- Project Title
- Global Project
- Size
- Group
- Revision
- Date
- Sheet
- of
- Filename
- Designers

### Library data of the parts
C39 C42 = CAP_‎‎‎‎CL21B105KAFNNNE‎: CAP CER 1uF 25V 0805; Part number: CL21B105KAFNNNE‎
C40 C41 C43 C44 = CAP_‎‎CL05A104KA5NNNC‎: CAP CER 0.1uF 25V 0402; Part number: CL05A104KA5NNNC‎
J1 J2 = 629105150921: Micro USB 2.0 Type AB Receptacle WR-COM, Horizontal, SMT; Rated Current: 1.8 A; Contact Resistance: 30 mOhm; Working Voltage: 30 VAC; ComponentLink1Description: Manufacturer; ComponentLink1URL: http://www.we-online.de; ComponentLink2Description: Datasheet; ComponentLink2URL: https://katalog.we-online.de/em/datasheet/629105150921.pdf; Part Number: 629105150921; Published Date: September 2018; Publisher: Wurth Elektronik; Orientation: Horizontal; Connector Type: Micro USB 2.0 Type AB; Operating Temperature: -40 to 85 degC; Mounting Technology: SMT; Gender: Receptacle; Packaging: Tape and Reel
J3 = Barrel 5.5x2.5mm: Jack 5.5x2.5mm; Part number: *
Q7 Q8 = NMOS_DMN65D8L: NMOS_N-Channel 60V 310mA (Ta) 370mW (Ta); Vgs: 20V; Package: SOT-23; Id: 310mA; Vdss: 60V
R38-R41 = RES_‎‎‎‎‎RMCF0603FT27R0‎: RES 27R 1% 1/10W 0603; Power: 0.1W; Part number: RMCF0603FT27R0‎
R42 R44 = RES_‎‎‎ERA-6AEB101V‎: RES 100R 1% 1/8W 0805; Part number: ‎ERA-6AEB101V‎
R43 R45 = RES_‎RMCF0805FT100K‎: RES 100K 1% 1/8W 0805; Part number: ‎RMCF0805FT100K‎
U8 = IC_USB ISOLATOR_ADUM3160: USB Isolator; Part number: ADUM3160
J4-J6 = MOLEX 4 POS - TERMINAL BLOCK 2 POS: Part number: *

## Sheet ADC.SchDoc
size Tabloid
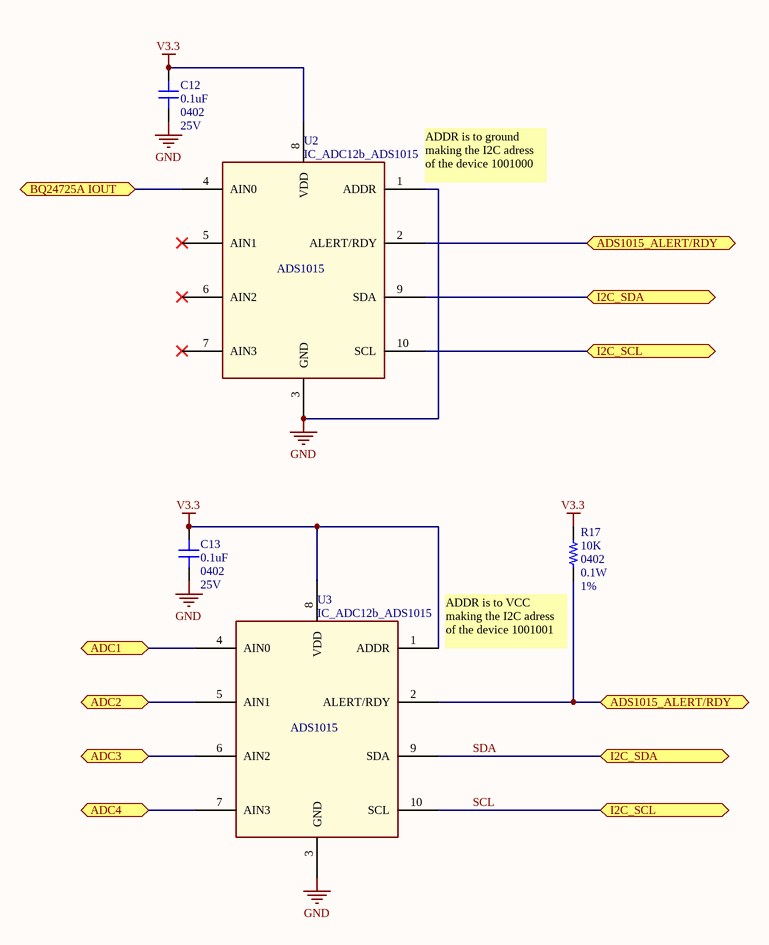
[diagram p4: ADC.SchDoc]

### Parts
C12  value 0.1uF  Package: 0402  Voltage: 25V  [CAP_0402]  (hidden comment: CAP_‎‎CL05A104KA5NNNC‎)
C13  value 0.1uF  Package: 0402  Voltage: 25V  [CAP_0402]  (hidden comment: CAP_‎‎CL05A104KA5NNNC‎)
R17  value 10K  Package: 0402  Power: 0.1W  Tolerance: 1%  [RES_0402]  (hidden comment: RES_‎MCS0402MC1002FE000‎)
U2  IC_ADC12b_ADS1015  [ADS1015]
U3  IC_ADC12b_ADS1015  [ADS1015]

### Ports
ADC1, ADC2, ADC3, ADC4, ADS1015_ALERT/RDY, BQ24725A IOUT, I2C_SCL, I2C_SDA

### Nets
GND: C12.2 C13.2 U2.1(ADDR) U2.3(GND) U3.3(GND)
V3.3: C12.1 C13.1 R17.1 U2.8(VDD) U3.1(ADDR) U3.8(VDD)
IOUT: U2.4(AIN0) ; port BQ24725A IOUT
SCL: U2.10(SCL) U3.10(SCL) ; port I2C_SCL
SDA: U2.9(SDA) U3.9(SDA) ; port I2C_SDA
NetC6_1: U3.5(AIN1) ; port ADC2
NetC7_1: U3.4(AIN0) ; port ADC1
NetR8_2: U3.6(AIN2) ; port ADC3
NetR9_2: U3.7(AIN3) ; port ADC4
NetR17_2: R17.2 U2.2(ALERT/RDY) U3.2(ALERT/RDY) ; port ADS1015_ALERT/RDY

Not connected (* = marked no-connect by the designer): U2 5(AIN1)* 6(AIN2)* 7(AIN3)*

### Notes on the sheet
- (near U2) ADDR is to ground making the I2C adress of the device 1001000
- (near R17) ADDR is to VCC making the I2C adress of the device 1001001
- Sheet Name
- Project Title
- Global Project
- Size
- Group
- Revision
- Date
- Sheet
- of
- Filename
- Designers

### Library data of the parts
C12 C13 = CAP_‎‎CL05A104KA5NNNC‎: CAP CER 0.1uF 25V 0402; Part number: CL05A104KA5NNNC‎
R17 = RES_‎MCS0402MC1002FE000‎: RES 10K 1% 1/10W 0402; Part number: ‎MCS0402MC1002FE000‎
U2 U3 = IC_ADC12b_ADS1015: ADC 12-bits with Internal Reference, Oscillator, and Programmable Comparator; Part number: ADS1015

## Sheet DC_DC_5V.SchDoc
size Tabloid
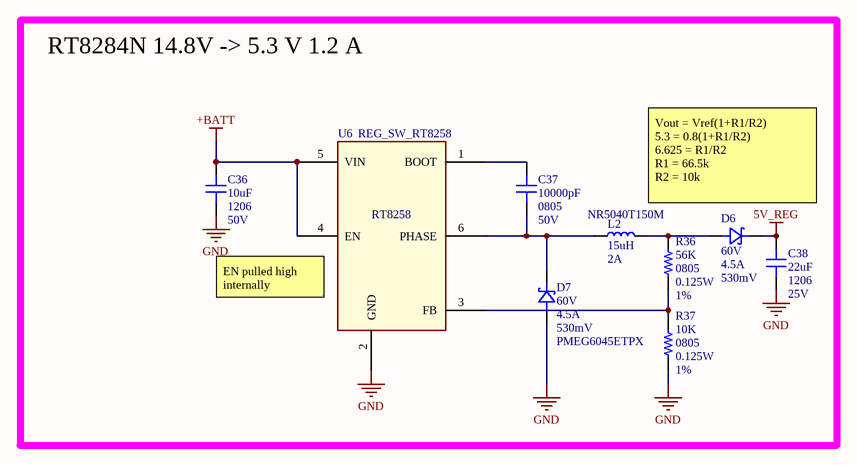
[diagram p5: DC_DC_5V.SchDoc]

### Parts
C36  value 10uF  Package: 1206  Voltage: 50V  [CAP_1206]  (hidden comment: CAP_GRT31CR61H106ME01L‎)
C37  value 10000pF  Package: 0805  Voltage: 50V  [CAP_0805]  (hidden comment: CAP_‎‎‎‎CL21B103KBANNNC)
C38  value 22uF  Package: 1206  Voltage: 25V  [CAP_1206]  (hidden comment: CAP_‎‎CL31A226KAHNNNE‎)
D6  Voltage: 60V  Current: 4.5A  Vf: 530mV  [DO-214AC_SOD128]  (hidden comment: DIODE_SCH_PMEG6045ETPX)
D7  Voltage: 60V  Current: 4.5A  Vf: 530mV  Part number: PMEG6045ETPX  [DO-214AC_SOD128]  (hidden comment: DIODE_SCH_PMEG6045ETPX)
L2  value 15uH  Current: 2A  [NR5040T150M]  (hidden comment: IND_NR5040T150M)
R36  value 56K  Package: 0805  Power: 0.125W  Tolerance: 1%  [RES_0805]  (hidden comment: RES_‎‎‎‎RC0805FR-0756KL)
R37  value 10K  Package: 0805  Power: 0.125W  Tolerance: 1%  [RES_0805]  (hidden comment: RES_‎‎‎‎‎RMCF0805FT10K0‎)
U6  REG_SW_RT8258  [SOT23-6]

### Blocks framed on the sheet
RT8284N 14.8V -> 5.3 V 1.2 A: C36-C38 D6 D7 L2 R36 R37 U6

### Nets
5V_REG: C38.1 D6.2
+BATT: C36.1 U6.4(EN) U6.5(VIN)
GND: C36.2 C38.2 D7.1 R37.2 U6.2(GND)
NetC37_1: C37.1 U6.1(BOOT)
NetC37_2: C37.2 D7.2 L2.1 U6.6(PHASE)
NetD6_1: D6.1 L2.2 R36.1
NetR36_2: R36.2 R37.1 U6.3(FB)

### Notes on the sheet
- Vout = Vref(1+R1/R2)
  5.3 = 0.8(1+R1/R2)
  6.625 = R1/R2
  R1 = 66.5k
  R2 = 10k
- (near U6) EN pulled high internally
- Sheet Name
- Project Title
- Global Project
- Size
- Group
- Revision
- Date
- Sheet
- of
- Filename
- Designers

### Library data of the parts
C36 = CAP_GRT31CR61H106ME01L‎: CAP CER 10uF 50V 1206; Part number: GRT31CR61H106ME01L‎
C37 = CAP_‎‎‎‎CL21B103KBANNNC: CAP CER 10000pF 50V 0805; Part number: ‎CL21B103KBANNNC
C38 = CAP_‎‎CL31A226KAHNNNE‎: CAP CER 22uF 25V 1206; Part number: CL31A226KAHNNNE‎
D6 D7 = DIODE_SCH_PMEG6045ETPX: as D4 on sheet BatteryCharger; Package: SOD-128
  D6: Part number: PMEG6045ETPX
L2 = IND_NR5040T150M: 15µH Shielded Wirewound Inductor 1.8A 104mOhm Max Nonstandard; Package: Nonstandard; Part number: NR5040T150M
R36 = RES_‎‎‎‎RC0805FR-0756KL: RES 56K 1% 1/8W 0805; Part number: ‎RC0805FR-0756KL
R37 = RES_‎‎‎‎‎RMCF0805FT10K0‎: RES 10K 1% 1/8W 0805; Part number: ‎RMCF0805FT10K0‎
U6 = REG_SW_RT8258: REG 1.2A, 24V, 700kHz Step-Down Converter; Part number: RT8258

## Nets that join several sheets
5V_REG: BatteryCharger (D4.2 RL1.1), MC (7 pins), DC_DC_5V (C38.1 D6.2)
+BATT: Battery Front End (FH1.2), BatteryCharger (8 pins), DC_DC_5V (C36.1 U6.4 U6.5)
GND: Battery Front End (15 pins), BatteryCharger (23 pins), MC (20 pins), ADC (5 pins), DC_DC_5V (5 pins)
PowerIN: BatteryCharger (5 pins), MC (J3.1 J5.1 J5.3 J5.5)
V3.3: Battery Front End (R3.1 R4.1), BatteryCharger (R29.1 R30.1 R31.1 R32.1), MC (U7.27), ADC (6 pins)
VBATT: BatteryCharger (RL1.4), MC (J6.1 J6.3 J6.5)
BQ_ACOK: BatteryCharger (R32.2 U5.5), MC (U7.17)
BQ_SCL: BatteryCharger (R31.2 U5.9), MC (U7.19)
BQ_SDA: BatteryCharger (R30.2 U5.8), MC (U7.18)
IOUT: BatteryCharger (C35.1 U5.7), ADC (U2.4)
NetC6_1: Battery Front End (C6.1 U1.14), ADC (U3.5)
NetC7_1: Battery Front End (C7.1 U1.15), ADC (U3.4)
NetD4_1: BatteryCharger (D4.1 RL1.3), MC (Q7.3)
NetR8_2: Battery Front End (R8.2 R10.1), ADC (U3.6)
NetR9_2: Battery Front End (R9.2 R11.1), ADC (U3.7)
NetR17_2: MC (U7.16), ADC (R17.2 U2.2 U3.2)
NetU1_13: Battery Front End (U1.13), MC (U7.13)
NetU4_5: BatteryCharger (U4.5), MC (U7.23)
SCL: Battery Front End (R3.2 U1.19), MC (U7.15), ADC (U2.10 U3.10)
SDA: Battery Front End (R4.2 U1.18), MC (U7.14), ADC (U2.9 U3.9)